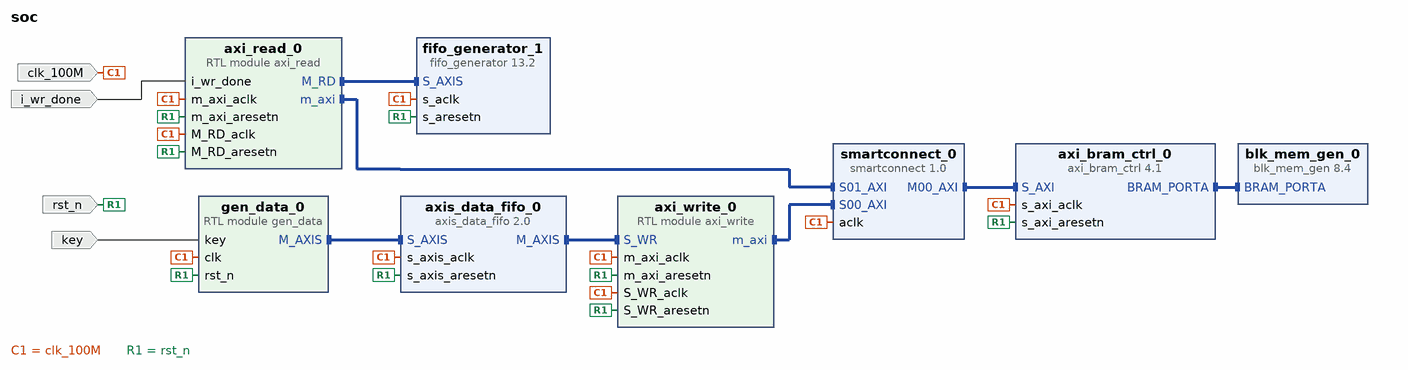
[diagram p0: block diagram of the top level]
# Vivado block design soc, xc7z020clg484-1, Vivado 2019.2
create_bd_design soc

create_bd_port -dir I -type clk clk_100M
create_bd_port -dir I -type rst rst_n
create_bd_port -dir I i_wr_done
create_bd_port -dir I key

create_bd_cell -type ip -vlnv xilinx.com:ip:blk_mem_gen:8.4 blk_mem_gen_0
create_bd_cell -type ip -vlnv xilinx.com:ip:axi_bram_ctrl:4.1 axi_bram_ctrl_0
set_property -dict {CONFIG.SINGLE_PORT_BRAM 1} [get_bd_cells axi_bram_ctrl_0]
create_bd_cell -type ip -vlnv xilinx.com:ip:smartconnect:1.0 smartconnect_0
create_bd_cell -type ip -vlnv xilinx.com:ip:fifo_generator:13.2 fifo_generator_1
set_property -dict [list \
  CONFIG.Enable_Safety_Circuit true \
  CONFIG.Enable_TLAST true \
  CONFIG.FIFO_Implementation_rach Common_Clock_Distributed_RAM \
  CONFIG.FIFO_Implementation_wach Common_Clock_Distributed_RAM \
  CONFIG.FIFO_Implementation_wrch Common_Clock_Distributed_RAM \
  CONFIG.Full_Flags_Reset_Value 1 \
  CONFIG.INTERFACE_TYPE AXI_STREAM \
  CONFIG.TDATA_NUM_BYTES 4 \
  CONFIG.TUSER_WIDTH 0 \
] [get_bd_cells fifo_generator_1]
create_bd_cell -type ip -vlnv xilinx.com:ip:axis_data_fifo:2.0 axis_data_fifo_0
create_bd_cell -type module -reference gen_data gen_data_0
create_bd_cell -type module -reference axi_read axi_read_0
set_property -dict {CONFIG.RD_DATA_WIDTH 32 CONFIG.RD_LIN 1} [get_bd_cells axi_read_0]
create_bd_cell -type module -reference axi_write axi_write_0
set_property -dict {CONFIG.WR_DATA_WIDTH 32 CONFIG.WR_LIN 1} [get_bd_cells axi_write_0]

# ---- connections ----

connect_bd_intf_net [get_bd_intf_pins axi_bram_ctrl_0/BRAM_PORTA] [get_bd_intf_pins blk_mem_gen_0/BRAM_PORTA]
connect_bd_intf_net [get_bd_intf_pins smartconnect_0/M00_AXI] [get_bd_intf_pins axi_bram_ctrl_0/S_AXI]
connect_bd_intf_net [get_bd_intf_pins axi_read_0/m_axi] [get_bd_intf_pins smartconnect_0/S01_AXI]
connect_bd_intf_net [get_bd_intf_pins axi_write_0/m_axi] [get_bd_intf_pins smartconnect_0/S00_AXI]
connect_bd_intf_net [get_bd_intf_pins fifo_generator_1/S_AXIS] [get_bd_intf_pins axi_read_0/M_RD]
connect_bd_intf_net [get_bd_intf_pins axis_data_fifo_0/S_AXIS] [get_bd_intf_pins gen_data_0/M_AXIS]
connect_bd_intf_net [get_bd_intf_pins axi_write_0/S_WR] [get_bd_intf_pins axis_data_fifo_0/M_AXIS]
connect_bd_net -net clk_0_1 [get_bd_ports clk_100M] \
  [get_bd_pins axi_bram_ctrl_0/s_axi_aclk] [get_bd_pins smartconnect_0/aclk] [get_bd_pins fifo_generator_1/s_aclk] \
  [get_bd_pins axis_data_fifo_0/s_axis_aclk] [get_bd_pins gen_data_0/clk] [get_bd_pins axi_read_0/M_RD_aclk] \
  [get_bd_pins axi_read_0/m_axi_aclk] [get_bd_pins axi_write_0/S_WR_aclk] [get_bd_pins axi_write_0/m_axi_aclk]
connect_bd_net -net rst_n_0_1 [get_bd_ports rst_n] \
  [get_bd_pins axi_bram_ctrl_0/s_axi_aresetn] [get_bd_pins fifo_generator_1/s_aresetn] \
  [get_bd_pins axis_data_fifo_0/s_axis_aresetn] [get_bd_pins gen_data_0/rst_n] [get_bd_pins axi_read_0/M_RD_aresetn] \
  [get_bd_pins axi_read_0/m_axi_aresetn] [get_bd_pins axi_write_0/S_WR_aresetn] [get_bd_pins axi_write_0/m_axi_aresetn]
connect_bd_net -net i_wr_done_0_1 [get_bd_ports i_wr_done] [get_bd_pins axi_read_0/i_wr_done]
connect_bd_net -net key_0_1 [get_bd_ports key] [get_bd_pins gen_data_0/key]

# ---- address map ----
assign_bd_address -offset 0x00000000 -range 64K -target_address_space [get_bd_addr_spaces axi_read_0/m_axi] [get_bd_addr_segs axi_bram_ctrl_0/S_AXI/Mem0]
assign_bd_address -offset 0x00000000 -range 64K -target_address_space [get_bd_addr_spaces axi_write_0/m_axi] [get_bd_addr_segs axi_bram_ctrl_0/S_AXI/Mem0]

validate_bd_design
save_bd_design
